# EAGLE design skyshieldv2.3 (EAGLE 7.2.0)
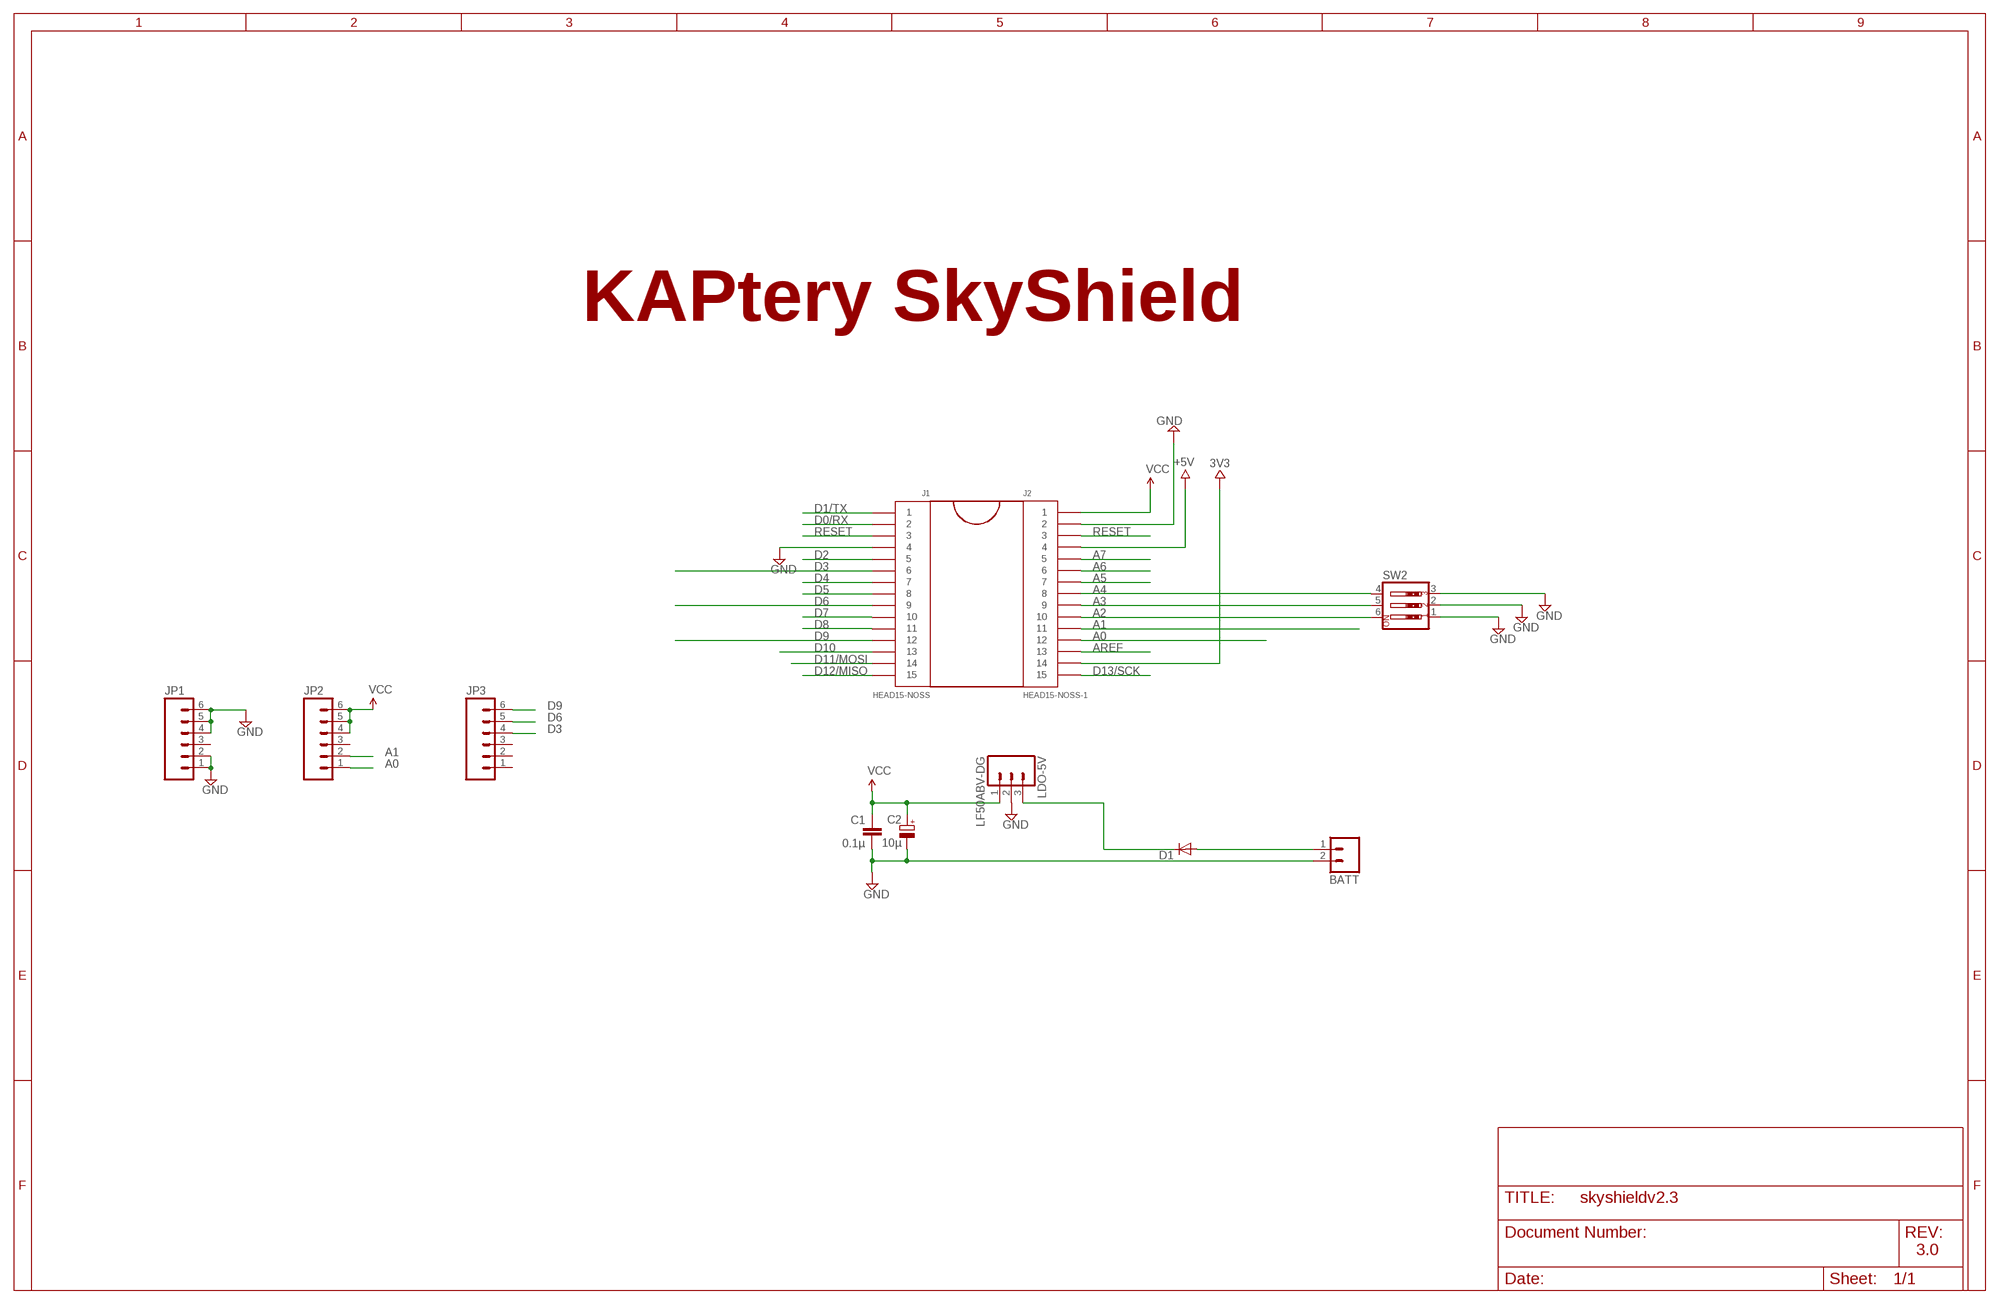
[diagram p0: schematic, sheet 1]

## Parts
BATT  M02PTH  [1X02]
C1  0.1µ  C-EU025-024X044  [C025-024X044]
C2  10µ  CPOL-EUE1.8-4  [E1,8-4]
D1  DIODE-D-5  [D-5]
J1  HEAD15-NOSS  [HEAD15-NOSS]
J2  HEAD15-NOSS-1  [HEAD15-NOSS-1]
JP1  M06LOCK  [1X06_LOCK]
JP2  M06LOCK  [1X06_LOCK]
JP3  M06LOCK  [1X06_LOCK]
LDO-5V  LF50ABV-DG  M03PTH  [1X03]
SW2  SW_DIP-3  [EDG-03]

## Nets
3V3: J2.14
+5V: J2.4
A0: J2.12 JP2.1
A1: J2.11 JP2.2
A2: J2.10 SW2.6
A3: J2.9 SW2.5
A4: J2.8 SW2.4
A5: J2.7
A6: J2.6
A7: J2.5
AREF: J2.13
D0/RX: J1.2
D1/TX: J1.1
D2: J1.5
D3: J1.6 JP3.4
D4: J1.7
D5: J1.8
D6: J1.9 JP3.5
D7: J1.10
D8: J1.11
D9: J1.12 JP3.6
D10: J1.13
D11/MOSI: J1.14
D12/MISO: J1.15
D13/SCK: J2.15
GND [power]: BATT.2 C1.2 C2.- J1.4 J2.2 JP1.1 JP1.2 JP1.4 JP1.5 JP1.6 LDO-5V.2 SW2.1 SW2.2 SW2.3
N$1: BATT.1 D1.A
N$6: D1.C LDO-5V.3
RESET: J1.3 J2.3
VCC [power]: C1.1 C2.+ J2.1 JP2.4 JP2.5 JP2.6 LDO-5V.1
Unconnected: JP1.3 JP2.3 JP3.1 JP3.2 JP3.3

## Notes on the sheet
- KAPtery SkyShield
- 3.0

## Library data of the parts
BATT = SparkFun-Connectors:M02: Standard 2-pin 0.1" header. Use with - straight break away headers ( PRT-00116) - right angle break away headers (PRT-00553) - swiss pins (PRT-00743) - machine pins (PRT-00117) - female headers (PRT-00115) Molex polarized connector foot print use with: PRT-08233 with associated crimp pins and housings. 2.54_SCREWTERM for use with PRT-10571. 3.5mm Screw Terminal footprints for PRT-08084 5mm Screw Terminal footprints for use with PRT-08432
C1 = resistor:C-EU: CAPACITOR, European symbol
C2 = resistor:CPOL-EU: POLARIZED CAPACITOR, European symbol
D1 = diode:DIODE-: DIODE
J1 = MyCON2:HEAD15-NOSS
J2 = MyCON2:HEAD15-NOSS-1
JP1-JP3 = SparkFun-Connectors:M06: Header 6 Standard 6-pin 0.1" header. Use with straight break away headers (SKU : PRT-00116), right angle break away headers (PRT-00553), swiss pins (PRT-00743), machine pins (PRT-00117), and female headers (PRT-00115). Molex polarized connector foot print use with SKU : PRT-08094 with associated crimp pins and housings. NOTES ON THE VARIANTS LOCK and LOCK_LONGPADS... This footprint was designed to help hold the alignment of a through-hole component (i.e. 6-pin header) while soldering it into place. You may notice that each hole has been shifted either up or down by 0.005 of an inch from it's more standard position (which is a perfectly straight line). This slight alteration caused the pins (the squares in the middle) to touch the edges of the holes. Because they are alternating, it causes a "brace" to hold the component in place. 0.005 has proven to be the perfect amount of "off-center" position when using our standard breakaway headers. Although looks a little odd when you look at the bare footprint, once you have a header in there, the alteration is very hard to notice. Also,if you push a header all the way into place, it is covered up entirely on the bottom side. This idea of altering the position of holes to aid alignment will be further integrated into the Sparkfun Library for other footprints. It can help hold any component with 3 or more connection pins.
LDO-5V = SparkFun-Connectors:M03: Header 3 Standard 3-pin 0.1" header. Use with straight break away headers (SKU : PRT-00116), right angle break away headers (PRT-00553), swiss pins (PRT-00743), machine pins (PRT-00117), and female headers (PRT-00115). Molex polarized connector foot print use with SKU : PRT-08232 with associated crimp pins and housings.
SW2 = special:SW_DIP-3: DIP SWITCH

## Net classes
1 power: width 0.381 mm, clearance 0.254 mm

## Board
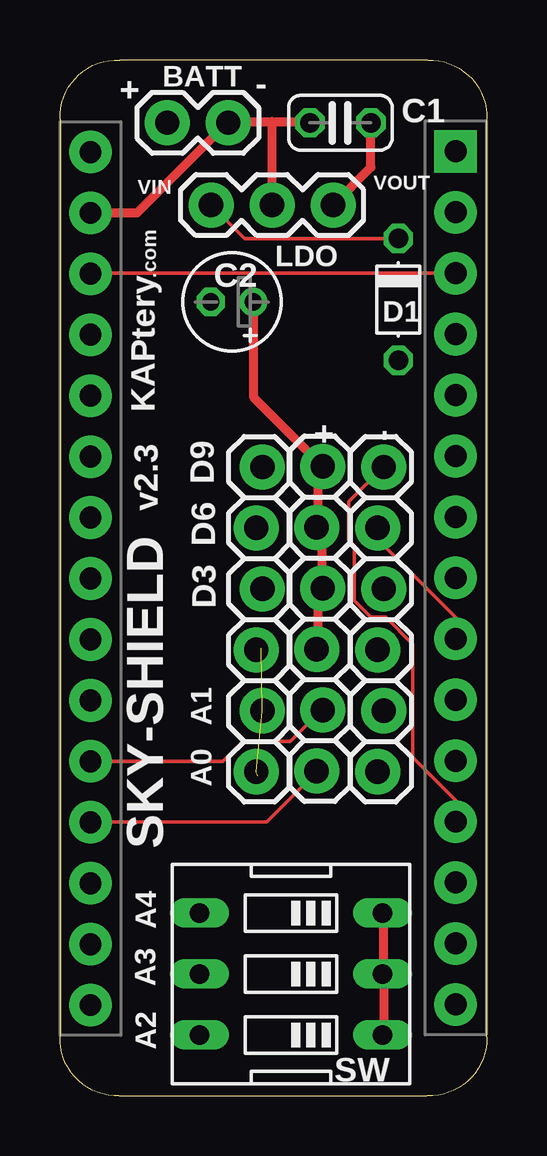
[diagram p1: board, top side]
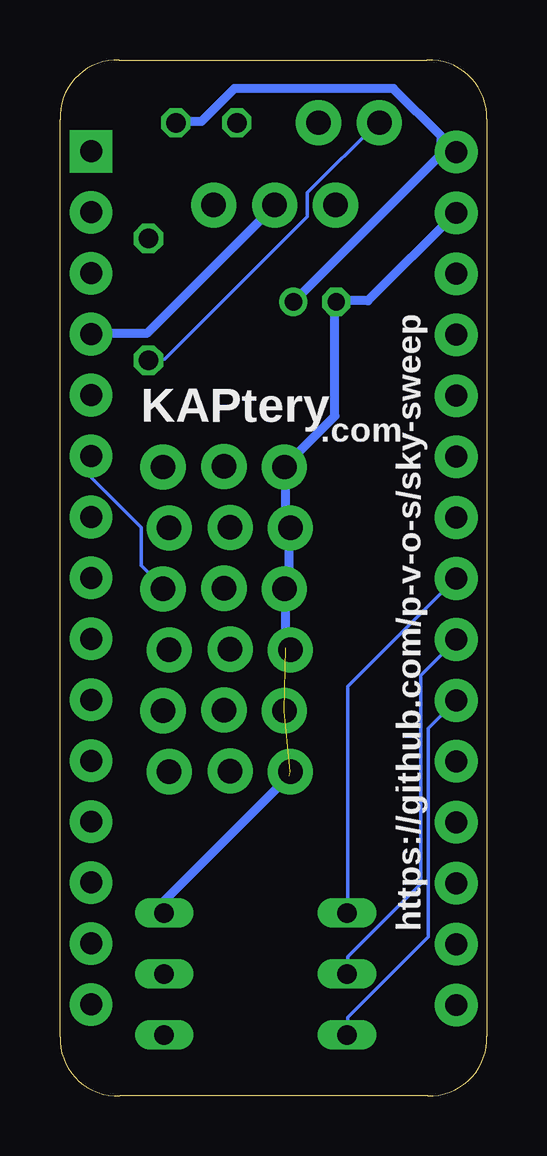
[diagram p2: board, bottom side, seen from below]

Size 17.78 x 43.18 mm. Coordinates in mm from the lower left corner, seen from the top.
Outline: 2.46,0 15.29,0 arc94 17.78,2.46 17.78,40.69 arc94 15.32,43.18 2.49,43.18 arc94 0,40.72 0,2.49 arc94 2.46,0
Copper layers (1*16): Top 0.0356mm / dielectric 1.5011mm / Bottom 0.0356mm
Design rules "LaenPCBOrder": minimum track width 6mil, minimum drill 13mil, track to track 6mil, track to pad 6mil, pad to pad 6mil, via to via 6mil, smd to smd 6mil, copper to edge 15mil, drill to drill 6mil, minimum pad ring 7mil, minimum via ring 7mil, stop-mask expansion 3mil, vias tented up to drill 0mil, thermal gap 10mil

### Footprints (pad centres in the part's own frame; a part is rotated, then mirrored left to right if it is on the bottom)
1X02 = drill 1.016 pad 1.88: 1 0,0; 2 2.54,0
C025-024X044 = drill 0.813 octagon: 1 -1.27,0; 2 1.27,0
E1,8-4 = drill 0.711 pad 1.168: + -0.889,0 | drill 0.711 pad 1.168 octagon: - 0.889,0
D-5 = drill 0.813 octagon: A 2.54,0; C -2.54,0
HEAD15-NOSS = drill 0.914 pad 1.778 square: 1 0,0 | drill 0.914 pad 1.778: 2 2.54,0; 3 5.08,0; 4 7.62,0; 5 10.16,0; 6 12.7,0; 7 15.24,0; 8 17.78,0; 9 20.32,0; 10 22.86,0; 11 25.4,0; 12 27.94,0; 13 30.48,0; 14 33.02,0; 15 35.56,0
HEAD15-NOSS-1 = drill 0.914 pad 1.778: 1 0,0; 2 2.54,0; 3 5.08,0; 4 7.62,0; 5 10.16,0; 6 12.7,0; 7 15.24,0; 8 17.78,0; 9 20.32,0; 10 22.86,0; 11 25.4,0; 12 27.94,0; 13 30.48,0; 14 33.02,0; 15 35.56,0
1X06_LOCK = drill 1.016 pad 1.88: 1 0,0; 2 2.54,-0.254; 3 5.08,0; 4 7.62,-0.254; 5 10.16,0; 6 12.7,-0.254
1X03 = drill 1.016 pad 1.88: 1 0,0; 2 2.54,0; 3 5.08,0
EDG-03 = drill 0.813 long: 1 -2.54,-3.81; 2 0,-3.81; 3 2.54,-3.81; 4 2.54,3.81; 5 0,3.81; 6 -2.54,3.81

### Placement (x,y rotation side)
BATT  4.47,40.56 0 top
C1  11.68,40.56 180 top
C2  7.16,33.1 180 top
D1  14.1,33.2 270 top
J1  16.48,39.37 270 top
J2  1.27,39.34 270 top
JP1  8.18,13.51 90 top
JP2  10.69,13.54 90 top
JP3  13.23,13.51 90 top
LDO-5V  11.38,37.13 180 top
SW2  9.63,5.08 90 top

### Tracks (layer width: path | path; a pad name or v marks a point on that pad's centre or on a via)
A0
  Top 0.152: J2.12 1.29,11.43 8.61,11.43 10.67,13.49 JP2.1
A1
  Top 0.152: J2.11 6.78,13.95 7.62,14.78 9.6,14.78 10.9,16.08 JP2.2
A2
  Bottom 0.152: J2.10 2.44,15.32 2.44,6.63 5.79,3.28 5.79,2.59 SW2.6
A3
  Bottom 0.152: SW2.5 5.79,5.11 5.79,5.79 2.74,8.84 2.74,17.53 1.29,18.97 J2.9
A4
  Bottom 0.152: SW2.4 5.79,7.62 5.79,17.07 1.29,21.57 J2.8
D3
  Bottom 0.152: J1.6 16.46,26.67 16.46,25.76 14.4,23.7 14.4,22.1 13.49,21.18 JP3.4
D6
  Top 0.152: J1.9 16.46,19.05 16.46,19.96 13.26,23.16 13.26,23.62 JP3.5
D9
  Top 0.152: JP3.6 12.04,24.77 12.04,23.16 12.27,22.94 12.27,20.65 12.95,19.96 13.56,19.96 14.71,18.82 14.71,14.1 16.46,12.34 16.46,11.43 J1.12
GND  (3 unrouted)
  Top 0.381: 8.84,40.62 7.01,40.62 BATT.2 6.86,40.46 3.2,36.8 J2.2 | 8.84,40.62 10.36,40.62 C1.2 | LDO-5V.2 8.84,40.62 | SW2.1 13.49,2.59 13.49,5.03 SW2.2 13.49,5.26 13.49,7.62 SW2.3
  Bottom 0.381: J2.2 1.29,36.8 4.95,33.15 6.25,33.15 C2.- 6.33,32.92 6.33,28.35 8.31,26.36 JP1.6 8.38,26.21 8.38,24 8.23,23.85 JP1.5 8.23,23.62 8.23,21.18 JP1.4 8.38,21.11 8.38,18.67 | J1.4 16.46,31.77 14.17,31.77 8.84,37.11 LDO-5V.2 | 8.23,13.34 13.41,8.15 13.41,7.62 SW2.3
N$1
  Bottom 0.152: D1.A 14.1,30.71 13.41,30.71 7.47,36.65 7.47,37.64 4.5,40.62 BATT.1
N$6
  Top 0.152: D1.C 7.7,35.74 LDO-5V.3
RESET
  Top 0.152: J1.3 1.29,34.29 J2.3
VCC
  Top 0.381: C1.1 12.95,38.71 LDO-5V.1 | 10.74,18.67 10.74,20.95 JP2.4 10.9,21.34 10.9,23.62 JP2.5 10.74,23.7 10.74,25.91 10.9,26.06 JP2.6 8.08,29.11 8.08,33.07 C2.+
  Bottom 0.381: C2.+ 1.83,39.32 1.29,39.32 J2.1 1.91,39.47 1.91,40.01 3.89,41.99 10.52,41.99 11.89,40.62 12.95,40.62 C1.1

### Text on the board
tPlace: BATT | + | - | C1 | VIN | VOUT | C2 | LDO | KAPtery | .com | D1 | + | v2.3 | D9 | - | D6 | D3 | A1 | A0 | SKY-SHIELD | A4 | A3 | A2 | SW
bPlace: KAPtery | .com | https://github.com/p-v-o-s/sky-sweep